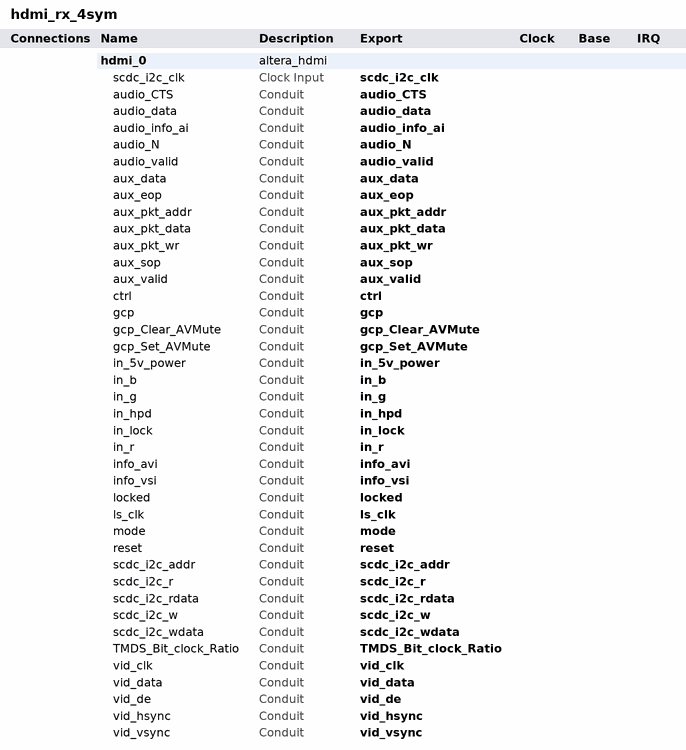
[diagram p0: system contents]
# Platform Designer (Qsys) system hdmi_rx_4sym, Arria V Unknown
# Parameters at their usual value, and those the tool derives, are not listed.
package require -exact qsys 15.1
create_system hdmi_rx_4sym
set_project_property DEVICE_FAMILY {Arria V}
set_project_property DEVICE Unknown

add_instance hdmi_0 altera_hdmi 15.1
set_instance_property hdmi_0 AUTO_EXPORT true
set_instance_parameter_value hdmi_0 DIRECTION rx
set_instance_parameter_value hdmi_0 FAMILY {Arria V}
set_instance_parameter_value hdmi_0 SUPPORT_AUDIO 1
set_instance_parameter_value hdmi_0 SUPPORT_AUXILIARY 1
set_instance_parameter_value hdmi_0 SUPPORT_DEEP_COLOR 0
set_instance_parameter_value hdmi_0 SYMBOLS_PER_CLOCK 4

# exported interfaces
add_interface TMDS_Bit_clock_Ratio conduit end
set_interface_property TMDS_Bit_clock_Ratio EXPORT_OF hdmi_0.TMDS_Bit_clock_Ratio
add_interface audio_CTS conduit end
set_interface_property audio_CTS EXPORT_OF hdmi_0.audio_CTS
add_interface audio_N conduit end
set_interface_property audio_N EXPORT_OF hdmi_0.audio_N
add_interface audio_data conduit end
set_interface_property audio_data EXPORT_OF hdmi_0.audio_data
add_interface audio_info_ai conduit end
set_interface_property audio_info_ai EXPORT_OF hdmi_0.audio_info_ai
add_interface audio_valid conduit end
set_interface_property audio_valid EXPORT_OF hdmi_0.audio_valid
add_interface aux_data conduit end
set_interface_property aux_data EXPORT_OF hdmi_0.aux_data
add_interface aux_eop conduit end
set_interface_property aux_eop EXPORT_OF hdmi_0.aux_eop
add_interface aux_pkt_addr conduit end
set_interface_property aux_pkt_addr EXPORT_OF hdmi_0.aux_pkt_addr
add_interface aux_pkt_data conduit end
set_interface_property aux_pkt_data EXPORT_OF hdmi_0.aux_pkt_data
add_interface aux_pkt_wr conduit end
set_interface_property aux_pkt_wr EXPORT_OF hdmi_0.aux_pkt_wr
add_interface aux_sop conduit end
set_interface_property aux_sop EXPORT_OF hdmi_0.aux_sop
add_interface aux_valid conduit end
set_interface_property aux_valid EXPORT_OF hdmi_0.aux_valid
add_interface ctrl conduit end
set_interface_property ctrl EXPORT_OF hdmi_0.ctrl
add_interface gcp conduit end
set_interface_property gcp EXPORT_OF hdmi_0.gcp
add_interface gcp_Clear_AVMute conduit end
set_interface_property gcp_Clear_AVMute EXPORT_OF hdmi_0.gcp_Clear_AVMute
add_interface gcp_Set_AVMute conduit end
set_interface_property gcp_Set_AVMute EXPORT_OF hdmi_0.gcp_Set_AVMute
add_interface in_5v_power conduit end
set_interface_property in_5v_power EXPORT_OF hdmi_0.in_5v_power
add_interface in_b conduit end
set_interface_property in_b EXPORT_OF hdmi_0.in_b
add_interface in_g conduit end
set_interface_property in_g EXPORT_OF hdmi_0.in_g
add_interface in_hpd conduit end
set_interface_property in_hpd EXPORT_OF hdmi_0.in_hpd
add_interface in_lock conduit end
set_interface_property in_lock EXPORT_OF hdmi_0.in_lock
add_interface in_r conduit end
set_interface_property in_r EXPORT_OF hdmi_0.in_r
add_interface info_avi conduit end
set_interface_property info_avi EXPORT_OF hdmi_0.info_avi
add_interface info_vsi conduit end
set_interface_property info_vsi EXPORT_OF hdmi_0.info_vsi
add_interface locked conduit end
set_interface_property locked EXPORT_OF hdmi_0.locked
add_interface ls_clk conduit end
set_interface_property ls_clk EXPORT_OF hdmi_0.ls_clk
add_interface mode conduit end
set_interface_property mode EXPORT_OF hdmi_0.mode
add_interface reset conduit end
set_interface_property reset EXPORT_OF hdmi_0.reset
add_interface scdc_i2c_addr conduit end
set_interface_property scdc_i2c_addr EXPORT_OF hdmi_0.scdc_i2c_addr
add_interface scdc_i2c_clk clock sink
set_interface_property scdc_i2c_clk EXPORT_OF hdmi_0.scdc_i2c_clk
add_interface scdc_i2c_r conduit end
set_interface_property scdc_i2c_r EXPORT_OF hdmi_0.scdc_i2c_r
add_interface scdc_i2c_rdata conduit end
set_interface_property scdc_i2c_rdata EXPORT_OF hdmi_0.scdc_i2c_rdata
add_interface scdc_i2c_w conduit end
set_interface_property scdc_i2c_w EXPORT_OF hdmi_0.scdc_i2c_w
add_interface scdc_i2c_wdata conduit end
set_interface_property scdc_i2c_wdata EXPORT_OF hdmi_0.scdc_i2c_wdata
add_interface vid_clk conduit end
set_interface_property vid_clk EXPORT_OF hdmi_0.vid_clk
add_interface vid_data conduit end
set_interface_property vid_data EXPORT_OF hdmi_0.vid_data
add_interface vid_de conduit end
set_interface_property vid_de EXPORT_OF hdmi_0.vid_de
add_interface vid_hsync conduit end
set_interface_property vid_hsync EXPORT_OF hdmi_0.vid_hsync
add_interface vid_vsync conduit end
set_interface_property vid_vsync EXPORT_OF hdmi_0.vid_vsync

set_interconnect_requirement {$system} qsys_mm.clockCrossingAdapter HANDSHAKE
set_interconnect_requirement {$system} qsys_mm.enableEccProtection FALSE
set_interconnect_requirement {$system} qsys_mm.insertDefaultSlave FALSE
set_interconnect_requirement {$system} qsys_mm.maxAdditionalLatency 1

save_system hdmi_rx_4sym.qsys
